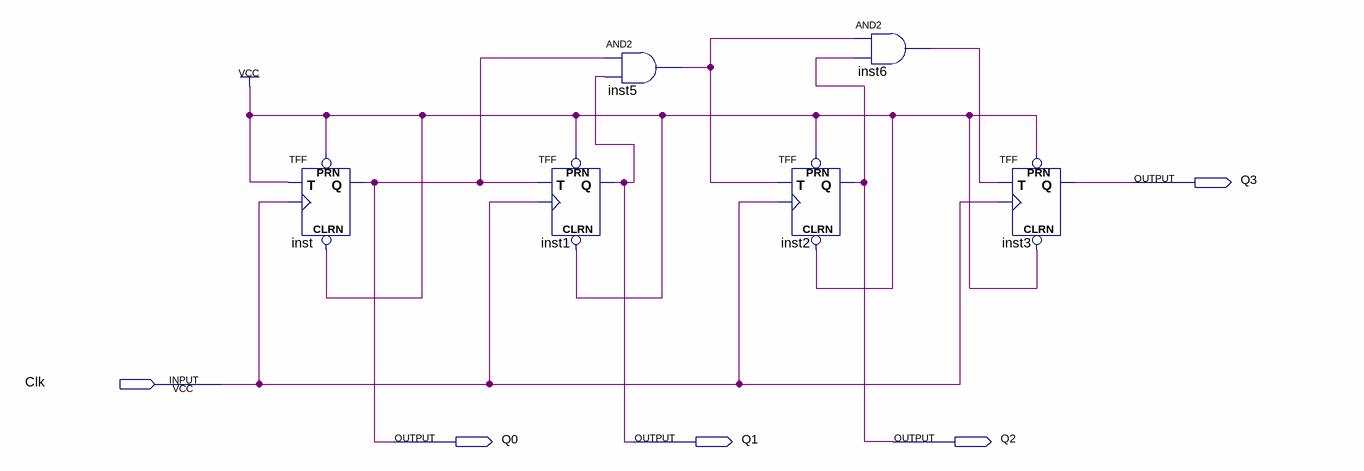
[diagram p0: schematic sheet]
// Quartus schematic Lab10step2b.bdf as structural Verilog: 6 symbols, 5 pins
module Lab10step2b (
  input  Clk,
  output Q3,
  output Q0,
  output Q1,
  output Q2
);

  wire inst5_out, inst6_out;

  TFF inst (.PRN(1'b1), .CLRN(1'b1), .T(1'b1), .CLK(Clk), .Q(Q0));
  TFF inst1 (.PRN(1'b1), .CLRN(1'b1), .T(Q0), .CLK(Clk), .Q(Q1));
  and inst5 (inst5_out, Q0, Q1);
  TFF inst2 (.PRN(1'b1), .CLRN(1'b1), .T(inst5_out), .CLK(Clk), .Q(Q2));
  and inst6 (inst6_out, inst5_out, Q2);
  TFF inst3 (.PRN(1'b1), .CLRN(1'b1), .T(inst6_out), .CLK(Clk), .Q(Q3));
endmodule
